# Altium schematic sheet DS18B20U Module Schematic.SchDoc
size A4
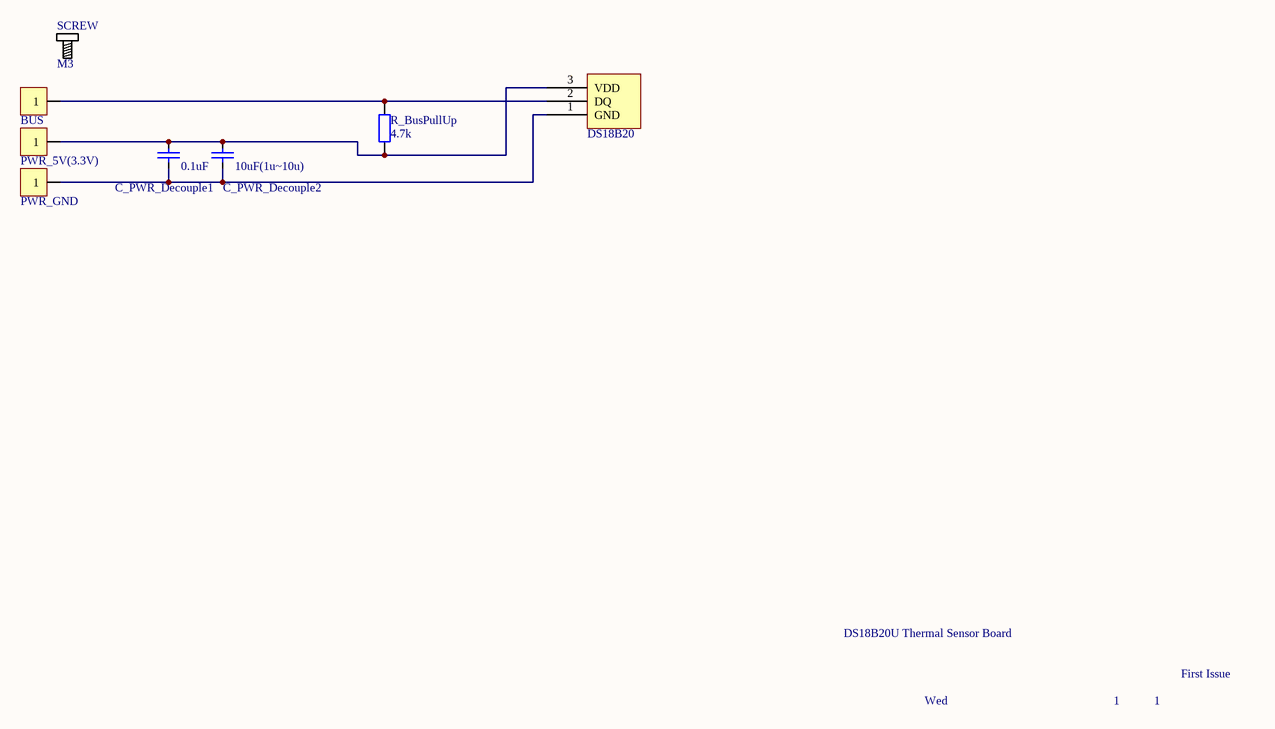
[diagram p0: DS18B20U Module Schematic.SchDoc]

## Parts
BUS  HDR1X1_180_2.54  [HDR1X1_180_2.54]  (value not drawn)
C_PWR_Decouple1  value 0.1uF  [CAP_0603]  (hidden comment: Cap_0603)
C_PWR_Decouple2  value 10uF(1u~10u)  [CAP_0603]  (hidden comment: Cap_0603)
DS18B20  DS18B20  [TO-92]  (value not drawn)
PWR_5V(3.3V)  HDR1X1_180_2.54  [HDR1X1_180_2.54]  (value not drawn)
PWR_GND  HDR1X1_180_2.54  [HDR1X1_180_2.54]  (value not drawn)
R_BusPullUp  value 4.7k  [RES_0603]  (hidden comment: Res_0603)
SCREW  M3  [SCRREW_M3]

## Nets
NetBUS_1: BUS.1 DS18B20.2(DQ) R_BusPullUp.2
NetC_PWR_Decouple1_1: C_PWR_Decouple1.1 C_PWR_Decouple2.1 DS18B20.1(GND) PWR_GND.1
NetC_PWR_Decouple1_2: C_PWR_Decouple1.2 C_PWR_Decouple2.2 DS18B20.3(VDD) PWR_5V(3.3V).1 R_BusPullUp.1

## Notes on the sheet
- DS18B20U Thermal Sensor Board
- Wed
- 1
- First Issue

## Library data of the parts
BUS PWR_5V(3.3V) PWR_GND = HDR1X1_180_2.54: Header
C_PWR_Decouple1 C_PWR_Decouple2 = Cap_0603: Capacitor
DS18B20 = DS18B20 TO-92
R_BusPullUp = Res_0603: Resistor
SCREW = Screw_M3: Screw